# Altium schematic sheet AIM2 - Bus Interface REVB.SchDoc: Bus Interface
size B; DrawnBy: DJW; DocumentNumber: 6; SheetNumber: 6; SheetTotal: 12
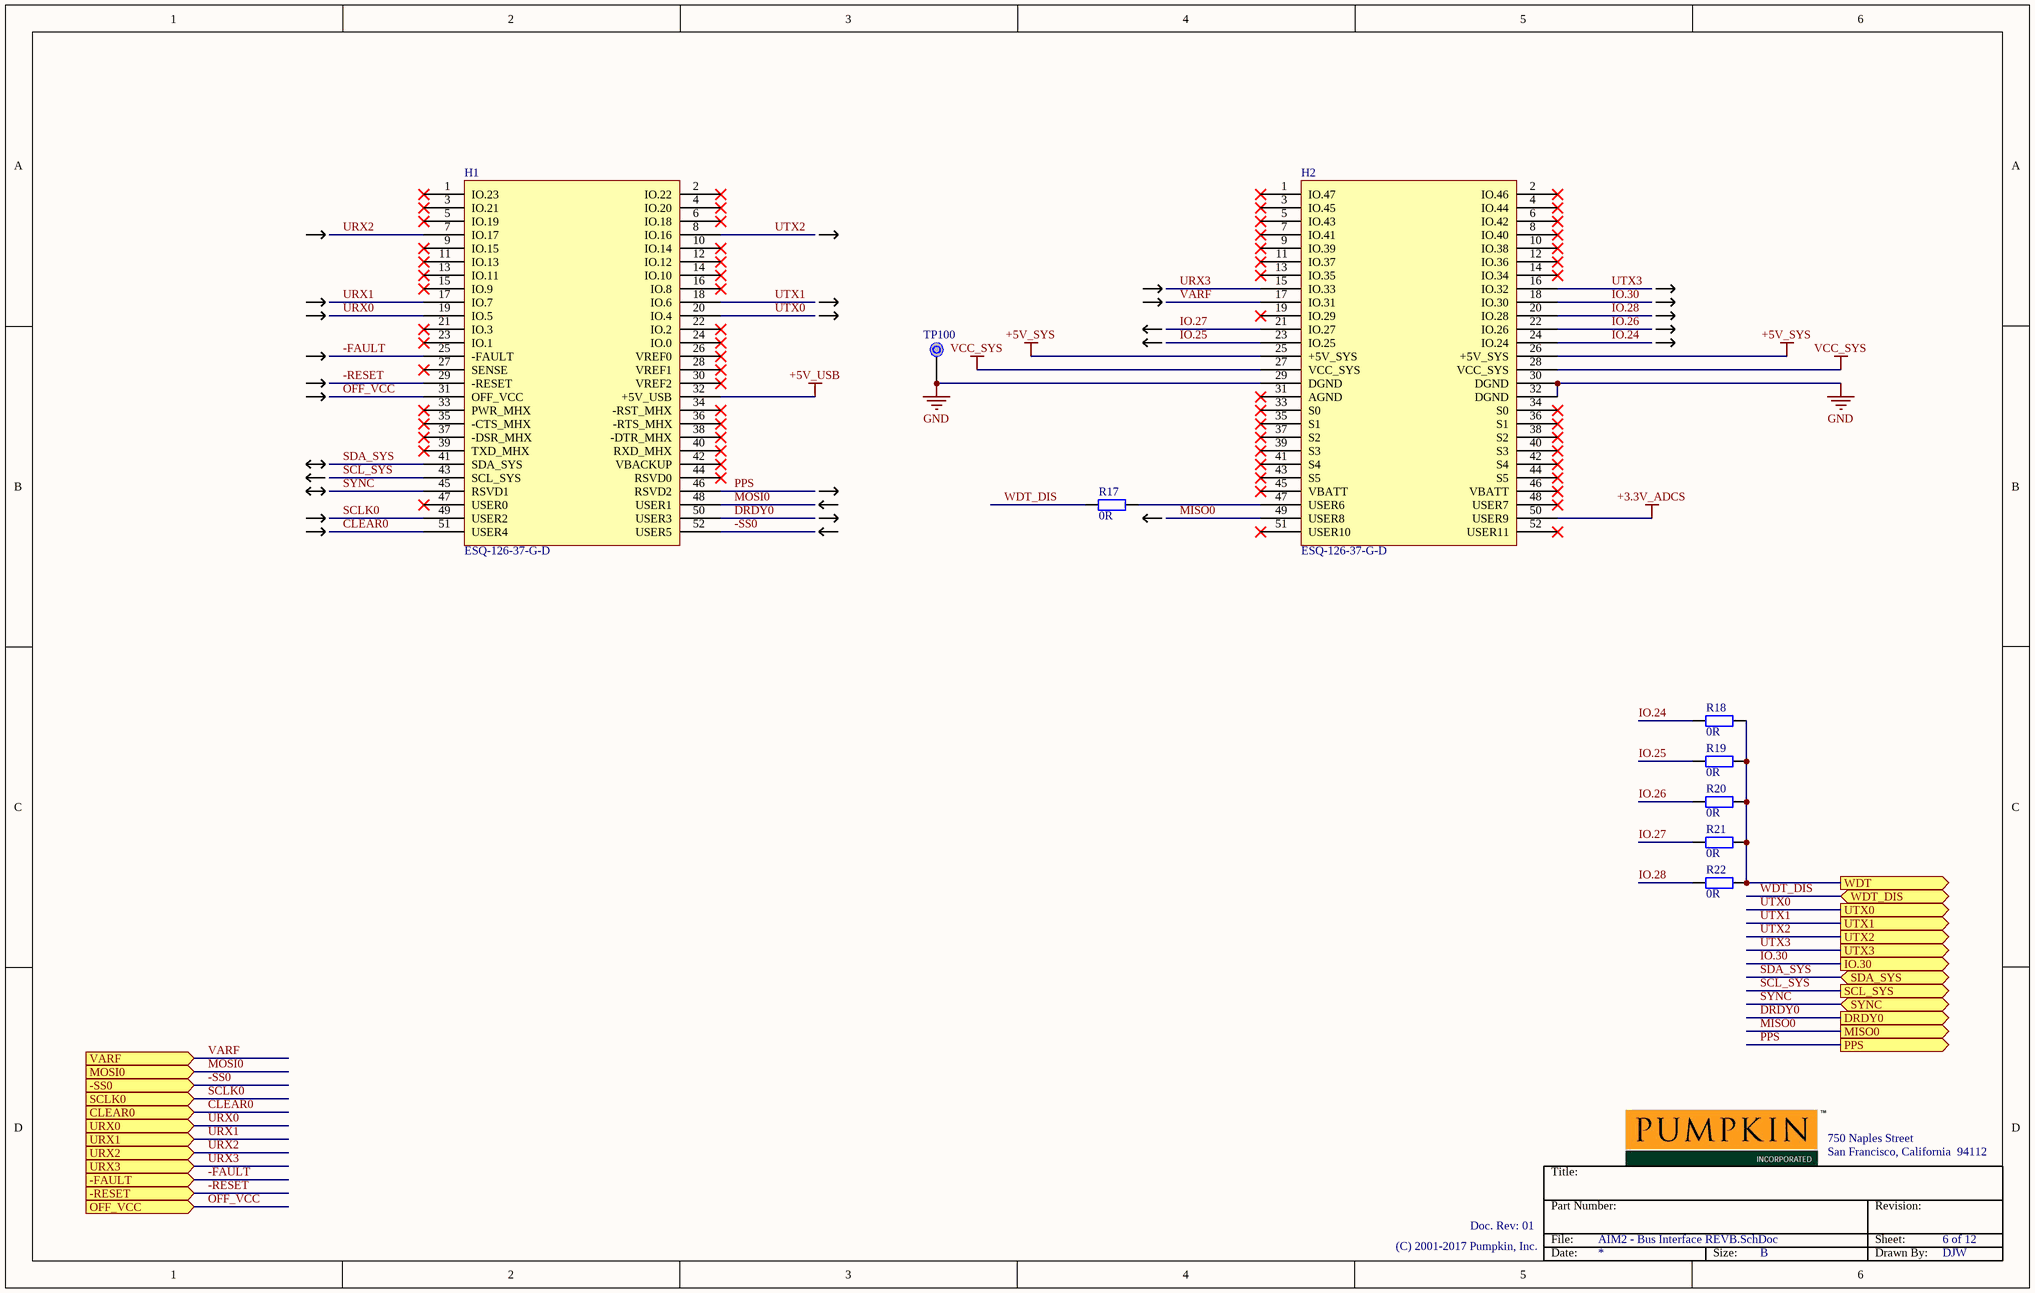
[diagram p0: AIM2 - Bus Interface REVB.SchDoc]

## Parts
H1  ESQ-126-37-G-D  [ESQ-126-37-G-D]
H2  ESQ-126-37-G-D  [ESQ-126-37-G-D]
R17  0R  [0805 RES - DNP]
R18  0R  [0805 RES - DNP]
R19  0R  [0805 RES - DNP]
R20  0R  [0805 RES - DNP]
R21  0R  [0805 RES - DNP]
R22  0R  [0805 RES - DNP]
TP100  GND Testpoint  [GND Testpoint]  (value not drawn)  (no BOM)

## Ports
-FAULT (in), -RESET (in), -SS0 (in), CLEAR0 (in), DRDY0 (out), IO.30 (out), MISO0 (out), MOSI0 (in), OFF_VCC (in), PPS (out), SCL_SYS (out), SCLK0 (in), SDA_SYS (bidir), SYNC (bidir), URX0 (in), URX1 (in), URX2 (in), URX3 (in), UTX0 (out), UTX1 (out), UTX2 (out), UTX3 (out), VARF (in), WDT (out), WDT_DIS (bidir)

## Nets
+3.3V_ADCS: H2.50(USER9)
+5V_SYS: H2.25(+5V_SYS) H2.26(+5V_SYS)
+5V_USB: H1.32(+5V_USB)
GND: H2.29(DGND) H2.30(DGND) H2.32(DGND) TP100.1
VCC_SYS: H2.27(VCC_SYS) H2.28(VCC_SYS)
-FAULT: H1.25(-FAULT) ; port -FAULT
-RESET: H1.29(-RESET) ; port -RESET
-SS0: H1.52(USER5) ; port -SS0
CLEAR0: H1.51(USER4) ; port CLEAR0
DRDY0: H1.50(USER3) ; port DRDY0
IO.24: H2.24(IO.24) R18.1
IO.25: H2.23(IO.25) R19.1
IO.26: H2.22(IO.26) R20.1
IO.27: H2.21(IO.27) R21.1
IO.28: H2.20(IO.28) R22.1
IO.30: H2.18(IO.30) ; port IO.30
MISO0: H2.49(USER8) ; port MISO0
MOSI0: H1.48(USER1) ; port MOSI0
OFF_VCC: H1.31(OFF_VCC) ; port OFF_VCC
PPS: H1.46(RSVD2) ; port PPS
SCL_SYS: H1.43(SCL_SYS) ; port SCL_SYS
SCLK0: H1.49(USER2) ; port SCLK0
SDA_SYS: H1.41(SDA_SYS) ; port SDA_SYS
SYNC: H1.45(RSVD1) ; port SYNC
URX0: H1.19(IO.5) ; port URX0
URX1: H1.17(IO.7) ; port URX1
URX2: H1.7(IO.17) ; port URX2
URX3: H2.15(IO.33) ; port URX3
UTX0: H1.20(IO.4) ; port UTX0
UTX1: H1.18(IO.6) ; port UTX1
UTX2: H1.8(IO.16) ; port UTX2
UTX3: H2.16(IO.32) ; port UTX3
VARF: H2.17(IO.31) ; port VARF
WDT: R18.2 R19.2 R20.2 R21.2 R22.2 ; port WDT
WDT_DIS: R17.1 ; port WDT_DIS
NetH2_47: H2.47(USER6) R17.2

Not connected (* = marked no-connect by the designer): H1 1(IO.23)* 2(IO.22)* 3(IO.21)* 4(IO.20)* 5(IO.19)* 6(IO.18)* 9(IO.15)* 10(IO.14)* 11(IO.13)* 12(IO.12)* 13(IO.11)* 14(IO.10)* 15(IO.9)* 16(IO.8)* 21(IO.3)* 22(IO.2)* 23(IO.1)* 24(IO.0)* 26(VREF0)* 27(SENSE)* 28(VREF1)* 30(VREF2)* 33(PWR_MHX)* 34(-RST_MHX)* 35(-CTS_MHX)* 36(-RTS_MHX)* 37(-DSR_MHX)* 38(-DTR_MHX)* 39(TXD_MHX)* 40(RXD_MHX)* 42(VBACKUP)* 44(RSVD0)* 47(USER0)*; H2 1(IO.47)* 2(IO.46)* 3(IO.45)* 4(IO.44)* 5(IO.43)* 6(IO.42)* 7(IO.41)* 8(IO.40)* 9(IO.39)* 10(IO.38)* 11(IO.37)* 12(IO.36)* 13(IO.35)* 14(IO.34)* 19(IO.29)* 31(AGND)* 33(S0)* 34(S0)* 35(S1)* 36(S1)* 37(S2)* 38(S2)* 39(S3)* 40(S3)* 41(S4)* 42(S4)* 43(S5)* 44(S5)* 45(VBATT)* 46(VBATT)* 48(USER7)* 51(USER10)* 52(USER11)*

## Notes on the sheet
- Title:
- 750 Naples Street
- San Francisco, California  94112
- Doc. Rev: 01
- File:
- Part Number:
- Revision:
- Sheet:
- (C) 2001-2017 Pumpkin, Inc.
- Date:
- Size:
- B
- Drawn By:

## Library data of the parts
H1 = CubesatBus-H1 ESQ-126-37-G-D: Header PC/104 52-pin; Supplier 1: Digi-Key; Supplier Part Number 1: SAM9323-ND
H2 = CubesatBus-H2 ESQ-126-37-G-D: Header PC/104 52-pin; Supplier 1: Digi-Key; Supplier Part Number 1: SAM9323-ND
R17-R22 = Resistor 0R 0805: Resistor 0R 0805 0.125W; Revision: Altium ETH 11-03.2008; Value: 0R; Supplier 1: Digi-Key; Supplier Part Number 1: P0.0ACT-ND
TP100 = GND Testpoint: Testpoint GND